# Altium schematic sheet [4] - MOTOR-DRIVER.SchDoc
size A
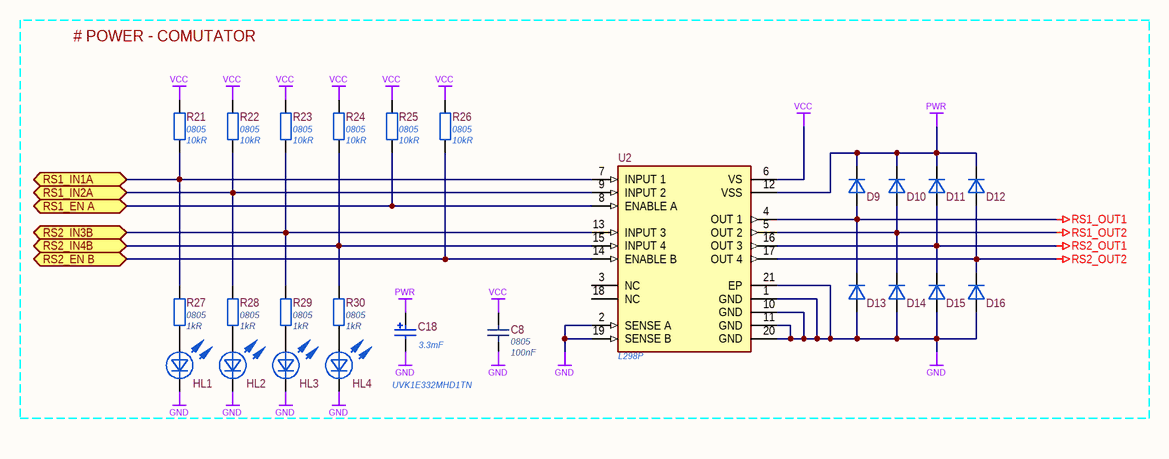
[diagram p0: [4] - MOTOR-DRIVER.SchDoc]

## Parts
C8  Case/Package: 0805  Capacitance: 100nF  [CH0805C]  (hidden comment: AC0805KRX7R9BB104)
C18  UVK1E332MHD1TN  Capacitance: 3.3mF  [El-d16-h26-F7.62]
D9  RS1MB-13-F  [SMB]  (value not drawn)
D10  RS1MB-13-F  [SMB]  (value not drawn)
D11  RS1MB-13-F  [SMB]  (value not drawn)
D12  RS1MB-13-F  [SMB]  (value not drawn)
D13  RS1MB-13-F  [SMB]  (value not drawn)
D14  RS1MB-13-F  [SMB]  (value not drawn)
D15  RS1MB-13-F  [SMB]  (value not drawn)
D16  RS1MB-13-F  [SMB]  (value not drawn)
HL1  SMLLXT0805GWTR  [CH0805LG]  (value not drawn)
HL2  SMLLXT0805GWTR  [CH0805LG]  (value not drawn)
HL3  SMLLXT0805GWTR  [CH0805LG]  (value not drawn)
HL4  SMLLXT0805GWTR  [CH0805LG]  (value not drawn)
R21  Case Code (Imperial): 0805  Resistance: 10kR  [CH0805R]  (hidden comment: RC0805JR-0710KL)
R22  Case Code (Imperial): 0805  Resistance: 10kR  [CH0805R]  (hidden comment: RC0805JR-0710KL)
R23  Case Code (Imperial): 0805  Resistance: 10kR  [CH0805R]  (hidden comment: RC0805JR-0710KL)
R24  Case Code (Imperial): 0805  Resistance: 10kR  [CH0805R]  (hidden comment: RC0805JR-0710KL)
R25  Case Code (Imperial): 0805  Resistance: 10kR  [CH0805R]  (hidden comment: RC0805JR-0710KL)
R26  Case Code (Imperial): 0805  Resistance: 10kR  [CH0805R]  (hidden comment: RC0805JR-0710KL)
R27  Case Code (Imperial): 0805  Resistance: 1kR  [CH0805R]  (hidden comment: RC0805JR-071KL)
R28  Case Code (Imperial): 0805  Resistance: 1kR  [CH0805R]  (hidden comment: RC0805JR-071KL)
R29  Case Code (Imperial): 0805  Resistance: 1kR  [CH0805R]  (hidden comment: RC0805JR-071KL)
R30  Case Code (Imperial): 0805  Resistance: 1kR  [CH0805R]  (hidden comment: RC0805JR-071KL)
U2  L298P  [STM-PowerSO20_N]

## Blocks framed on the sheet
# POWER - COMUTATOR: C8 C18 D9-D16 HL1-HL4 R21-R30 U2

## Ports
RS1_EN A (bidir), RS1_IN1A (bidir), RS1_IN2A (bidir), RS2_EN B (bidir), RS2_IN3B (bidir), RS2_IN4B (bidir)

## Nets
GND: C8.2 C18.2 D13.1(A) D14.1(A) D15.1(A) D16.1(A) HL1.2(K) HL2.2(K) HL3.2(K) HL4.2(K) U2.1(GND) U2.2(SENSE_A) U2.10(GND) U2.11(GND) U2.19(SENSE_B) U2.20(GND) U2.21(EP)
PWR: C18.1 D9.2(K) D10.2(K) D11.2(K) D12.2(K) U2.12(VSS)
RS1_OUT1: D9.1(A) D13.2(K) U2.4(OUT_1)
RS1_OUT2: D10.1(A) D14.2(K) U2.5(OUT_2)
RS2_OUT1: D11.1(A) D15.2(K) U2.16(OUT_3)
RS2_OUT2: D12.1(A) D16.2(K) U2.17(OUT_4)
VCC: C8.1 R21.2 R22.2 R23.2 R24.2 R25.2 R26.2 U2.6(VS)
RS1_EN A: R25.1 U2.8(ENABLE_A) ; port RS1_EN A
RS1_IN1A: R21.1 R27.2 U2.7(INPUT_1) ; port RS1_IN1A
RS1_IN2A: R22.1 R28.2 U2.9(INPUT_2) ; port RS1_IN2A
RS2_EN B: R26.1 U2.14(ENABLE_B) ; port RS2_EN B
RS2_IN3B: R23.1 R29.2 U2.13(INPUT_3) ; port RS2_IN3B
RS2_IN4B: R24.1 R30.2 U2.15(INPUT_4) ; port RS2_IN4B
NetHL1_1: HL1.1(A) R27.1
NetHL2_1: HL2.1(A) R28.1
NetHL3_1: HL3.1(A) R29.1
NetHL4_1: HL4.1(A) R30.1

Not connected (* = marked no-connect by the designer): U2 3(NC) 18(NC)

## Library data of the parts
C8 = AC0805KRX7R9BB104: 0.10µF 50V Ceramic Capacitor X7R 0805 (2012 Metric) 0.079" L x 0.049" W (2.00mm x 1.25mm); Manufacturer 1: Yageo; Tolerance: 10%; Supplier 1: Digi-Key; Manufacturer Part Number 1: AC0805KRX7R9BB104; Stock 1: 18765; Pricing 1: 1=0.23000, 10=0.15600, 100=0.07930, 500=0.05424, 1000=0.04799 (USD); RoHS: Yes; Mount: Surface Mount; Min Operating Temperature: -55°C; Max Operating Temperature: 125°C; Packaging: Tape and Reel; Voltage Rating: 50V; Length: 0.079inch; Width: 0.049inch; Thickness: 0.028inch; Ratings: AEC-Q200; Lead Free: Lead Free; ComponentLink1URL: http://www.yageo.com/documents/recent/UPY-AC_NP0X7R_16V-to-630V_12.pdf?src-supplier=Digi-Key; ComponentLink1Description: http://www.yageo.com/documents/recent/UPY-AC_NP0X7R_16V-to-630V_12.pdf?src-supplier=Digi-Key; Supplier Part Number 1: 311-3037-1-ND; Supplier 2: Digi-Key; Supplier Part Number 2: 311-1939-2-ND
C18 = UVK1E332MHD1TN: CAP ALUM 3300UF 20% 25V RADIAL; Manufacturer 1: Nichicon; Ripple Current: 1.98A; Life (Hours): 2000Hour; Supplier 1: Digi-Key; Manufacturer Part Number 1: UVK1E332MHD1TN; Stock 1: 317; Pricing 1: 1=1.13000, 10=0.89600, 100=0.67200 (USD); RoHS: Yes; Mount: Through Hole; Case/Package: Radial; Min Operating Temperature: -40°C; Max Operating Temperature: 85°C; Package Quantity: 1; Packaging: Tape and Reel; Tolerance: 20%; Voltage Rating: 25V; Lead Pitch: 0.295inch; Height - Seated (Max): 1.063inch; ComponentLink1URL: https://datasheet.ciiva.com/29547/e-vk-29547493.pdf?src-supplier=Digi-Key; ComponentLink1Description: https://datasheet.ciiva.com/29547/e-vk-29547493.pdf?src-supplier=Digi-Key; Supplier Part Number 1: 493-12564-1-ND
D9-D16 = RS1MB-13-F: DIODE GEN PURP 1KV 1A SMB; Manufacturer 1: Diodes; Polarity: Standard; Max Surge Current: 30A; Forward Voltage: 1.3V; Element Configuration: Single; Peak Reverse Current: 5uA; Recovery Time: 500ns; Capacitance: 15pF; Supplier 1: Digi-Key; Manufacturer Part Number 1: RS1MB-13-F; Stock 1: 40693; Pricing 1: 1=0.42000, 10=0.33900, 100=0.23070, 500=0.17304, 1000=0.12978 (USD); RoHS: Yes; Mount: Surface Mount; Case/Package: SMB; Number of Pins: 2; Weight: 0.00328oz; Min Operating Temperature: -65°C; Max Operating Temperature: 150°C; Package Quantity: 3000; Packaging: Tape and Reel; Average Rectified Current: 1A; Peak Non-Repetitive Surge Current: 30A; Voltage Rating (DC): 1kV; Current Rating: 1A; Output Current: 1A; Max Reverse Voltage (DC): 1kV; Max Repetitive Reverse Voltage (Vrrm): 1kV; Forward Current: 1A; Reverse Recovery Time: 500ns; Reverse Voltage (DC): 1kV; Length: 4.57mm; Height: 2.42mm; Width: 3.94mm; Radiation Hardening: No; Lead Free: Lead Free; ComponentLink1URL: https://datasheet.ciiva.com/8301/ds15002-8301350.pdf?src-supplier=Avnet; ComponentLink1Description: https://datasheet.ciiva.com/8301/ds15002-8301350.pdf?src-supplier=Avnet; ComponentLink2URL: https://datasheet.ciiva.com/8301/ds15002-8301721.pdf?src-supplier=Avnet; ComponentLink2Description: https://datasheet.ciiva.com/8301/ds15002-8301721.pdf?src-supplier=Avnet; ComponentLink3URL: https://datasheet.ciiva.com/26818/getdatasheetpartid-91887-26818092.pdf?src-supplier=Verical; ComponentLink3Description: https://datasheet.ciiva.com/26818/getdatasheetpartid-91887-26818092.pdf?src-supplier=Verical; ComponentLink4URL: https://datasheet.ciiva.com/25946/ds15002-25946239.pdf?src-supplier=Avnet+Europe; ComponentLink4Description: https://datasheet.ciiva.com/25946/ds15002-25946239.pdf?src-supplier=Avnet+Europe; Supplier Part Number 1: RS1MB-FDICT-ND
HL1-HL4 = SMLLXT0805GWTR: GLOVE, POLYAMIDE, L/FREE, PU, SIZE 6 - More Details; Manufacturer 1: Lumex; Color: Green; Lens Color: White; Lens Style: Rectangular,Diffused,Colorless; Luminous Intensity: 11mcd; Forward Voltage: 2V; Wavelength: 565nm; Forward Current: 20mA; Dominant Wavelength: 568nm; Number of LEDs: 1; Viewing Angle: 140°; Power Rating: 50mW; Lens Transparency: Diffused; Approvals: UL,CSA; Supplier 1: Newark; Manufacturer Part Number 1: SMLLXT0805GWTR; Stock 1: 0; RoHS: Yes; Mount: Surface Mount; Case/Package: 0805; Number of Pins: 2; Case Code (Metric): 2012; Case Code (Imperial): 0805; Min Operating Temperature: -25°C; Max Operating Temperature: 85°C; Package Quantity: 1; Packaging: Tape and Reel; Illumination Color: Green; Test Current: 20mA; Length: 2mm; Height: 0.8mm; Width: 1.25mm; Lead Free: Lead Free; REACH SVHC: No SVHC; ComponentLink1URL: https://datasheet.ciiva.com/2110/sml-lxt0805gw-tr-2110192.pdf?src-supplier=Digi-Key; ComponentLink1Description: https://datasheet.ciiva.com/2110/sml-lxt0805gw-tr-2110192.pdf?src-supplier=Digi-Key; ComponentLink2URL: https://datasheet.ciiva.com/4689/sml-lxt0805gw-tr-82662-4689266.pdf?src-supplier=Mouser; ComponentLink2Description: https://datasheet.ciiva.com/4689/sml-lxt0805gw-tr-82662-4689266.pdf?src-supplier=Mouser; ComponentLink3URL: https://datasheet.ciiva.com/30063/sml-lxt0805gw-tr-30063898.pdf?src-supplier=Onlinecomponents.com; ComponentLink3Description: https://datasheet.ciiva.com/30063/sml-lxt0805gw-tr-30063898.pdf?src-supplier=Onlinecomponents.com; ComponentLink4URL: https://datasheet.ciiva.com/2110/sml-lxt0805gw-tr-2110193.pdf?src-supplier=Digi-Key; ComponentLink4Description: https://datasheet.ciiva.com/2110/sml-lxt0805gw-tr-2110193.pdf?src-supplier=Digi-Key; ComponentLink5URL: https://datasheet.ciiva.com/2110/sml-lxt0805gw-tr-2110194.pdf?src-supplier=Digi-Key; ComponentLink5Description: https://datasheet.ciiva.com/2110/sml-lxt0805gw-tr-2110194.pdf?src-supplier=Digi-Key; ComponentLink6URL: https://datasheet.ciiva.com/16383/sml-lxt0805gw-tr-16383723.pdf?src-supplier=Future+Electronics; ComponentLink6Description: https://datasheet.ciiva.com/16383/sml-lxt0805gw-tr-16383723.pdf?src-supplier=Future+Electronics; Supplier Part Number 1: 58K2293
R21-R26 = RC0805JR-0710KL: RES SMD 10K OHM 5% 1/8W 0805; Manufacturer 1: Yageo; Power Rating: 125mW; Temperature Coefficient: 100ppm/°C; Voltage Rating: 150V; Supplier 1: Digi-Key; Manufacturer Part Number 1: RC0805JR-0710KL; Pricing 1: 1=0.10000, 10=0.03600, 100=0.01460, 1000=0.00654, 2500=0.00568 (USD); Case/Package: 0805; Contact Plating: Tin,Matte; Case Code (Metric): 2012; Min Operating Temperature: -55°C; Max Operating Temperature: 155°C; Composition: Thick Film; Tolerance: 5%; Packaging: Tape and Reel; Termination: SMD/SMT; Military Standard: Not; Length: 2mm; Height: 0.5mm; Width: 1.25mm; Depth: 1.25mm; Radiation Hardening: No; REACH SVHC: Unknown; Lead Free: Lead Free; ComponentLink1URL: https://datasheet.ciiva.com/7983/444164-7983765.pdf?src-supplier=Element14; ComponentLink1Description: https://datasheet.ciiva.com/7983/444164-7983765.pdf?src-supplier=Element14; ComponentLink2URL: https://datasheet.ciiva.com/7941/444164-7941870.pdf?src-supplier=Element14; ComponentLink2Description: https://datasheet.ciiva.com/7941/444164-7941870.pdf?src-supplier=Element14; ComponentLink3URL: https://datasheet.ciiva.com/7941/444164-7941871.pdf?src-supplier=Element14; ComponentLink3Description: https://datasheet.ciiva.com/7941/444164-7941871.pdf?src-supplier=Element14; Supplier Part Number 1: 311-10KARCT-ND; Stock 1: 13413905; RoHS: Yes
R27-R30 = RC0805JR-071KL: RES SMD 1K OHM 5% 1/8W 0805; Manufacturer 1: Yageo; Temperature Coefficient: 100ppm/°C; Power Rating: 125mW; Voltage Rating: 150V; Supplier 1: Digi-Key; Manufacturer Part Number 1: RC0805JR-071KL; Stock 1: 6592717; Pricing 1: 1=0.10000, 10=0.03600, 100=0.01460, 1000=0.00654, 2500=0.00568 (USD); RoHS: Yes; Case/Package: 0805; Contact Plating: Tin,Lead,Matte; Case Code (Metric): 2012; Min Operating Temperature: -55°C; Max Operating Temperature: 155°C; Tolerance: 5%; Composition: Thick Film; Packaging: Tape and Reel; Termination: SMD/SMT; Military Standard: Not; Length: 2mm; Depth: 1.25mm; Radiation Hardening: No; REACH SVHC: Unknown; Lead Free: Lead Free; ComponentLink1URL: https://datasheet.ciiva.com/15190/getdatasheetpartid-135056-15190037.pdf?src-supplier=Verical; ComponentLink1Description: https://datasheet.ciiva.com/15190/getdatasheetpartid-135056-15190037.pdf?src-supplier=Verical; ComponentLink2URL: https://datasheet.ciiva.com/12667/rc0805-12667110.pdf?src-supplier=Mouser; ComponentLink2Description: https://datasheet.ciiva.com/12667/rc0805-12667110.pdf?src-supplier=Mouser; ComponentLink3URL: https://datasheet.ciiva.com/7941/442941-7941911.pdf?src-supplier=Element14; ComponentLink3Description: https://datasheet.ciiva.com/7941/442941-7941911.pdf?src-supplier=Element14; ComponentLink4URL: https://datasheet.ciiva.com/7941/442941-7941912.pdf?src-supplier=Element14; ComponentLink4Description: https://datasheet.ciiva.com/7941/442941-7941912.pdf?src-supplier=Element14; ComponentLink5URL: https://datasheet.ciiva.com/46395/444164-46395131.pdf?src-supplier=Element14; ComponentLink5Description: https://datasheet.ciiva.com/46395/444164-46395131.pdf?src-supplier=Element14; Supplier Part Number 1: 311-1.0KARCT-ND
U2 = L298P: IC BRIDGE DRIVER PAR 20POWERSO; Manufacturer 1: STMicroelectronics; Operating Supply Voltage: 42V; Min Supply Voltage: 4.8V; Max Supply Voltage: 46V; Output Current: 2A; Number of Outputs: 4; Operating Supply Current: 13mA; Max Collector Current: 3A; Number of Channels: 2; Motor Type: Brushed; Supplier 1: Digi-Key; Manufacturer Part Number 1: L298P; Stock 1: 1834; Pricing 1: 1=5.96000, 10=5.38400, 100=4.45710, 500=3.88120, 1000=3.38040 (USD); RoHS: Yes; Mount: Surface Mount; Case/Package: SOIC; Number of Pins: 20; Min Operating Temperature: -25°C; Max Operating Temperature: 130°C; Packaging: Rail/Tube; Package Quantity: 31; Collector Emitter Voltage (VCEO): 46V; Max Output Current: 3A; Output Current per Channel: 2A; Length: 16mm; Height: 3.3mm; Width: 11.1mm; Radiation Hardening: No; Lead Free: Lead Free; ComponentLink1URL: https://datasheet.ciiva.com/19456/1389265-19456706.pdf?src-supplier=Jameco; ComponentLink1Description: https://datasheet.ciiva.com/19456/1389265-19456706.pdf?src-supplier=Jameco; ComponentLink2URL: https://datasheet.ciiva.com/4895/cd00000240-224711-4895923.pdf?src-supplier=Mouser; ComponentLink2Description: https://datasheet.ciiva.com/4895/cd00000240-224711-4895923.pdf?src-supplier=Mouser; ComponentLink3URL: https://datasheet.ciiva.com/15109/getdatasheetpartid-162293-15109403.pdf?src-supplier=Verical; ComponentLink3Description: https://datasheet.ciiva.com/15109/getdatasheetpartid-162293-15109403.pdf?src-supplier=Verical; ComponentLink4URL: https://datasheet.ciiva.com/26880/l298p-26880155.pdf?src-supplier=IIIC; ComponentLink4Description: https://datasheet.ciiva.com/26880/l298p-26880155.pdf?src-supplier=IIIC; ComponentLink5URL: https://datasheet.ciiva.com/1957/cd00000240-1957024.pdf?src-supplier=Digi-Key; ComponentLink5Description: https://datasheet.ciiva.com/1957/cd00000240-1957024.pdf?src-supplier=Digi-Key; Supplier Part Number 1: 497-1396-5-ND